# Altium schematic sheet 05-ModuleControls.SchDoc
size A
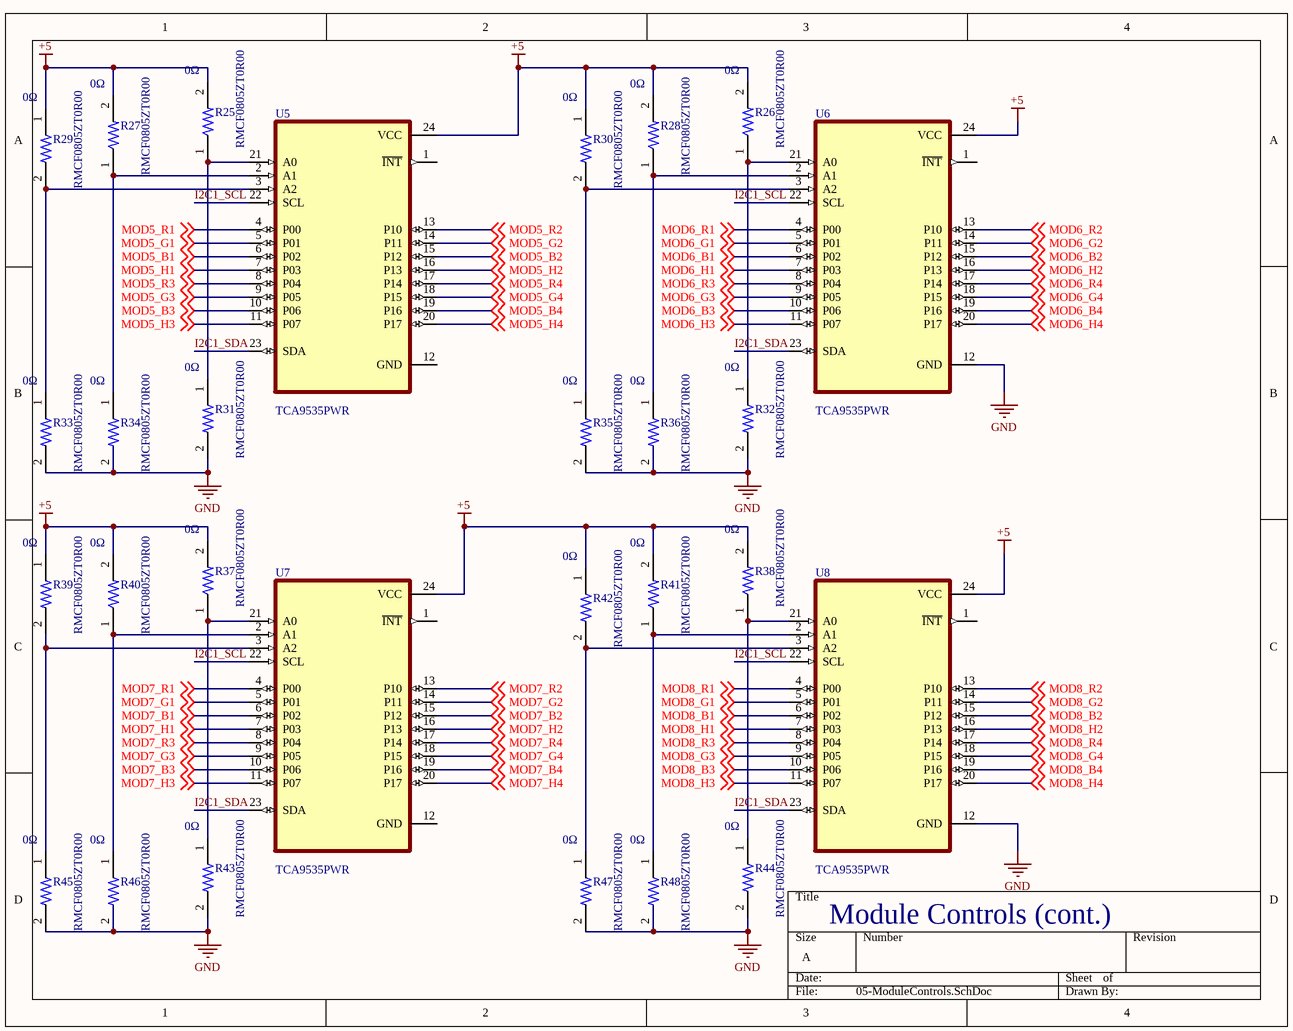
[diagram p0: 05-ModuleControls.SchDoc]

## Parts
R25  RMCF0805ZT0R00  Resitance: 0Ω  [RESC2012X60N]
R26  RMCF0805ZT0R00  Resitance: 0Ω  [RESC2012X60N]
R27  RMCF0805ZT0R00  Resitance: 0Ω  [RESC2012X60N]
R28  RMCF0805ZT0R00  Resitance: 0Ω  [RESC2012X60N]
R29  RMCF0805ZT0R00  Resitance: 0Ω  [RESC2012X60N]
R30  RMCF0805ZT0R00  Resitance: 0Ω  [RESC2012X60N]
R31  RMCF0805ZT0R00  Resitance: 0Ω  [RESC2012X60N]
R32  RMCF0805ZT0R00  Resitance: 0Ω  [RESC2012X60N]
R33  RMCF0805ZT0R00  Resitance: 0Ω  [RESC2012X60N]
R34  RMCF0805ZT0R00  Resitance: 0Ω  [RESC2012X60N]
R35  RMCF0805ZT0R00  Resitance: 0Ω  [RESC2012X60N]
R36  RMCF0805ZT0R00  Resitance: 0Ω  [RESC2012X60N]
R37  RMCF0805ZT0R00  Resitance: 0Ω  [RESC2012X60N]
R38  RMCF0805ZT0R00  Resitance: 0Ω  [RESC2012X60N]
R39  RMCF0805ZT0R00  Resitance: 0Ω  [RESC2012X60N]
R40  RMCF0805ZT0R00  Resitance: 0Ω  [RESC2012X60N]
R41  RMCF0805ZT0R00  Resitance: 0Ω  [RESC2012X60N]
R42  RMCF0805ZT0R00  Resitance: 0Ω  [RESC2012X60N]
R43  RMCF0805ZT0R00  Resitance: 0Ω  [RESC2012X60N]
R44  RMCF0805ZT0R00  Resitance: 0Ω  [RESC2012X60N]
R45  RMCF0805ZT0R00  Resitance: 0Ω  [RESC2012X60N]
R46  RMCF0805ZT0R00  Resitance: 0Ω  [RESC2012X60N]
R47  RMCF0805ZT0R00  Resitance: 0Ω  [RESC2012X60N]
R48  RMCF0805ZT0R00  Resitance: 0Ω  [RESC2012X60N]
U5  TCA9535PWR  [SOP65P640X120-24N]
U6  TCA9535PWR  [SOP65P640X120-24N]
U7  TCA9535PWR  [SOP65P640X120-24N]
U8  TCA9535PWR  [SOP65P640X120-24N]

## Nets
+5: R25.2 R26.2 R27.2 R28.2 R29.1 R30.1 R37.2 R38.2 R39.1 R40.2 R41.2 R42.1 U5.24(VCC) U6.24(VCC) U7.24(VCC) U8.24(VCC)
GND: R31.2 R32.2 R33.2 R34.2 R35.2 R36.2 R43.2 R44.2 R45.2 R46.2 R47.2 R48.2 U6.12(GND) U8.12(GND)
I2C1_SCL: U5.22(SCL) U6.22(SCL) U7.22(SCL) U8.22(SCL)
I2C1_SDA: U5.23(SDA) U6.23(SDA) U7.23(SDA) U8.23(SDA)
MOD5_B1: U5.6(P02) ; off-sheet MOD5_B1
MOD5_B2: U5.15(P12) ; off-sheet MOD5_B2
MOD5_B3: U5.10(P06) ; off-sheet MOD5_B3
MOD5_B4: U5.19(P16) ; off-sheet MOD5_B4
MOD5_G1: U5.5(P01) ; off-sheet MOD5_G1
MOD5_G2: U5.14(P11) ; off-sheet MOD5_G2
MOD5_G3: U5.9(P05) ; off-sheet MOD5_G3
MOD5_G4: U5.18(P15) ; off-sheet MOD5_G4
MOD5_H1: U5.7(P03) ; off-sheet MOD5_H1
MOD5_H2: U5.16(P13) ; off-sheet MOD5_H2
MOD5_H3: U5.11(P07) ; off-sheet MOD5_H3
MOD5_H4: U5.20(P17) ; off-sheet MOD5_H4
MOD5_R1: U5.4(P00) ; off-sheet MOD5_R1
MOD5_R2: U5.13(P10) ; off-sheet MOD5_R2
MOD5_R3: U5.8(P04) ; off-sheet MOD5_R3
MOD5_R4: U5.17(P14) ; off-sheet MOD5_R4
MOD6_B1: U6.6(P02) ; off-sheet MOD6_B1
MOD6_B2: U6.15(P12) ; off-sheet MOD6_B2
MOD6_B3: U6.10(P06) ; off-sheet MOD6_B3
MOD6_B4: U6.19(P16) ; off-sheet MOD6_B4
MOD6_G1: U6.5(P01) ; off-sheet MOD6_G1
MOD6_G2: U6.14(P11) ; off-sheet MOD6_G2
MOD6_G3: U6.9(P05) ; off-sheet MOD6_G3
MOD6_G4: U6.18(P15) ; off-sheet MOD6_G4
MOD6_H1: U6.7(P03) ; off-sheet MOD6_H1
MOD6_H2: U6.16(P13) ; off-sheet MOD6_H2
MOD6_H3: U6.11(P07) ; off-sheet MOD6_H3
MOD6_H4: U6.20(P17) ; off-sheet MOD6_H4
MOD6_R1: U6.4(P00) ; off-sheet MOD6_R1
MOD6_R2: U6.13(P10) ; off-sheet MOD6_R2
MOD6_R3: U6.8(P04) ; off-sheet MOD6_R3
MOD6_R4: U6.17(P14) ; off-sheet MOD6_R4
MOD7_B1: U7.6(P02) ; off-sheet MOD7_B1
MOD7_B2: U7.15(P12) ; off-sheet MOD7_B2
MOD7_B3: U7.10(P06) ; off-sheet MOD7_B3
MOD7_B4: U7.19(P16) ; off-sheet MOD7_B4
MOD7_G1: U7.5(P01) ; off-sheet MOD7_G1
MOD7_G2: U7.14(P11) ; off-sheet MOD7_G2
MOD7_G3: U7.9(P05) ; off-sheet MOD7_G3
MOD7_G4: U7.18(P15) ; off-sheet MOD7_G4
MOD7_H1: U7.7(P03) ; off-sheet MOD7_H1
MOD7_H2: U7.16(P13) ; off-sheet MOD7_H2
MOD7_H3: U7.11(P07) ; off-sheet MOD7_H3
MOD7_H4: U7.20(P17) ; off-sheet MOD7_H4
MOD7_R1: U7.4(P00) ; off-sheet MOD7_R1
MOD7_R2: U7.13(P10) ; off-sheet MOD7_R2
MOD7_R3: U7.8(P04) ; off-sheet MOD7_R3
MOD7_R4: U7.17(P14) ; off-sheet MOD7_R4
MOD8_B1: U8.6(P02) ; off-sheet MOD8_B1
MOD8_B2: U8.15(P12) ; off-sheet MOD8_B2
MOD8_B3: U8.10(P06) ; off-sheet MOD8_B3
MOD8_B4: U8.19(P16) ; off-sheet MOD8_B4
MOD8_G1: U8.5(P01) ; off-sheet MOD8_G1
MOD8_G2: U8.14(P11) ; off-sheet MOD8_G2
MOD8_G3: U8.9(P05) ; off-sheet MOD8_G3
MOD8_G4: U8.18(P15) ; off-sheet MOD8_G4
MOD8_H1: U8.7(P03) ; off-sheet MOD8_H1
MOD8_H2: U8.16(P13) ; off-sheet MOD8_H2
MOD8_H3: U8.11(P07) ; off-sheet MOD8_H3
MOD8_H4: U8.20(P17) ; off-sheet MOD8_H4
MOD8_R1: U8.4(P00) ; off-sheet MOD8_R1
MOD8_R2: U8.13(P10) ; off-sheet MOD8_R2
MOD8_R3: U8.8(P04) ; off-sheet MOD8_R3
MOD8_R4: U8.17(P14) ; off-sheet MOD8_R4
NetR25_1: R25.1 R31.1 U5.21(A0)
NetR26_1: R26.1 R32.1 U6.21(A0)
NetR27_1: R27.1 R34.1 U5.2(A1)
NetR28_1: R28.1 R36.1 U6.2(A1)
NetR29_2: R29.2 R33.1 U5.3(A2)
NetR30_2: R30.2 R35.1 U6.3(A2)
NetR37_1: R37.1 R43.1 U7.21(A0)
NetR38_1: R38.1 R44.1 U8.21(A0)
NetR39_2: R39.2 R45.1 U7.3(A2)
NetR40_1: R40.1 R46.1 U7.2(A1)
NetR41_1: R41.1 R48.1 U8.2(A1)
NetR42_2: R42.2 R47.1 U8.3(A2)

Not connected (* = marked no-connect by the designer): U5 1(~{INT}) 12(GND); U6 1(~{INT}); U7 1(~{INT}) 12(GND); U8 1(~{INT})

## Notes on the sheet
- Module Controls (cont.)

## Library data of the parts
R25-R48 = RMCF0805ZT0R00: 0 Ohms Jumper 0.125W, 1/8W Chip Resistor 0805 (2012 Metric) Automotive AEC-Q200 Thick Film; MF: Stackpole Electronics; DigiKey-Purchase-URL: https://snapeda.com/shop?store=DigiKey&id=492501; Package: 0805 Stackpole Electronics; Availability: Unavailable; MP: RMCF0805ZT0R00; SnapEDA_Link: https://www.snapeda.com/parts/RMCF0805ZT0R00/Stackpole%20Electronics%20Inc/view-part/492501/?ref=snap; Price: None; Parameter 1: *
U5-U8 = TCA9535PWR: Remote 16-Bit I2C and SMBus, Low-Power I/O Expander With Interrupt Output and Config Registers 24-TSSOP -40 to 85; MF: Texas Instruments; Texas_Instruments-Purchase-URL: https://snapeda.com/shop?store=Texas+Instruments&id=1237891; SnapEDA_Link: https://www.snapeda.com/parts/TCA9535PWR/Texas%20Instruments/view-part/1237891/?ref=snap; Availability: Good; Price: None; MP: TCA9535PWR; DigiKey-Purchase-URL: https://snapeda.com/shop?store=DigiKey&id=1237891; Package: TSSOP-24 Texas Instruments; Mouser-Purchase-URL: https://snapeda.com/shop?store=Mouser&id=1237891; Arrow_Electronics-Purchase-URL: https://snapeda.com/shop?store=Arrow+Electronics&id=1237891; Value: *